# EasyEDA Pro project Ext_sensors.eprj

# Schematic Schematic1
Board Name: Board1; Create Date: 2025-08-04; Page Name: P1; Project Name: Ext_sensors; Schematic Name: Schematic1; Update Date: 2025-08-04; Company: 嘉立创EDA; Page Size: A4; Version: V1.0
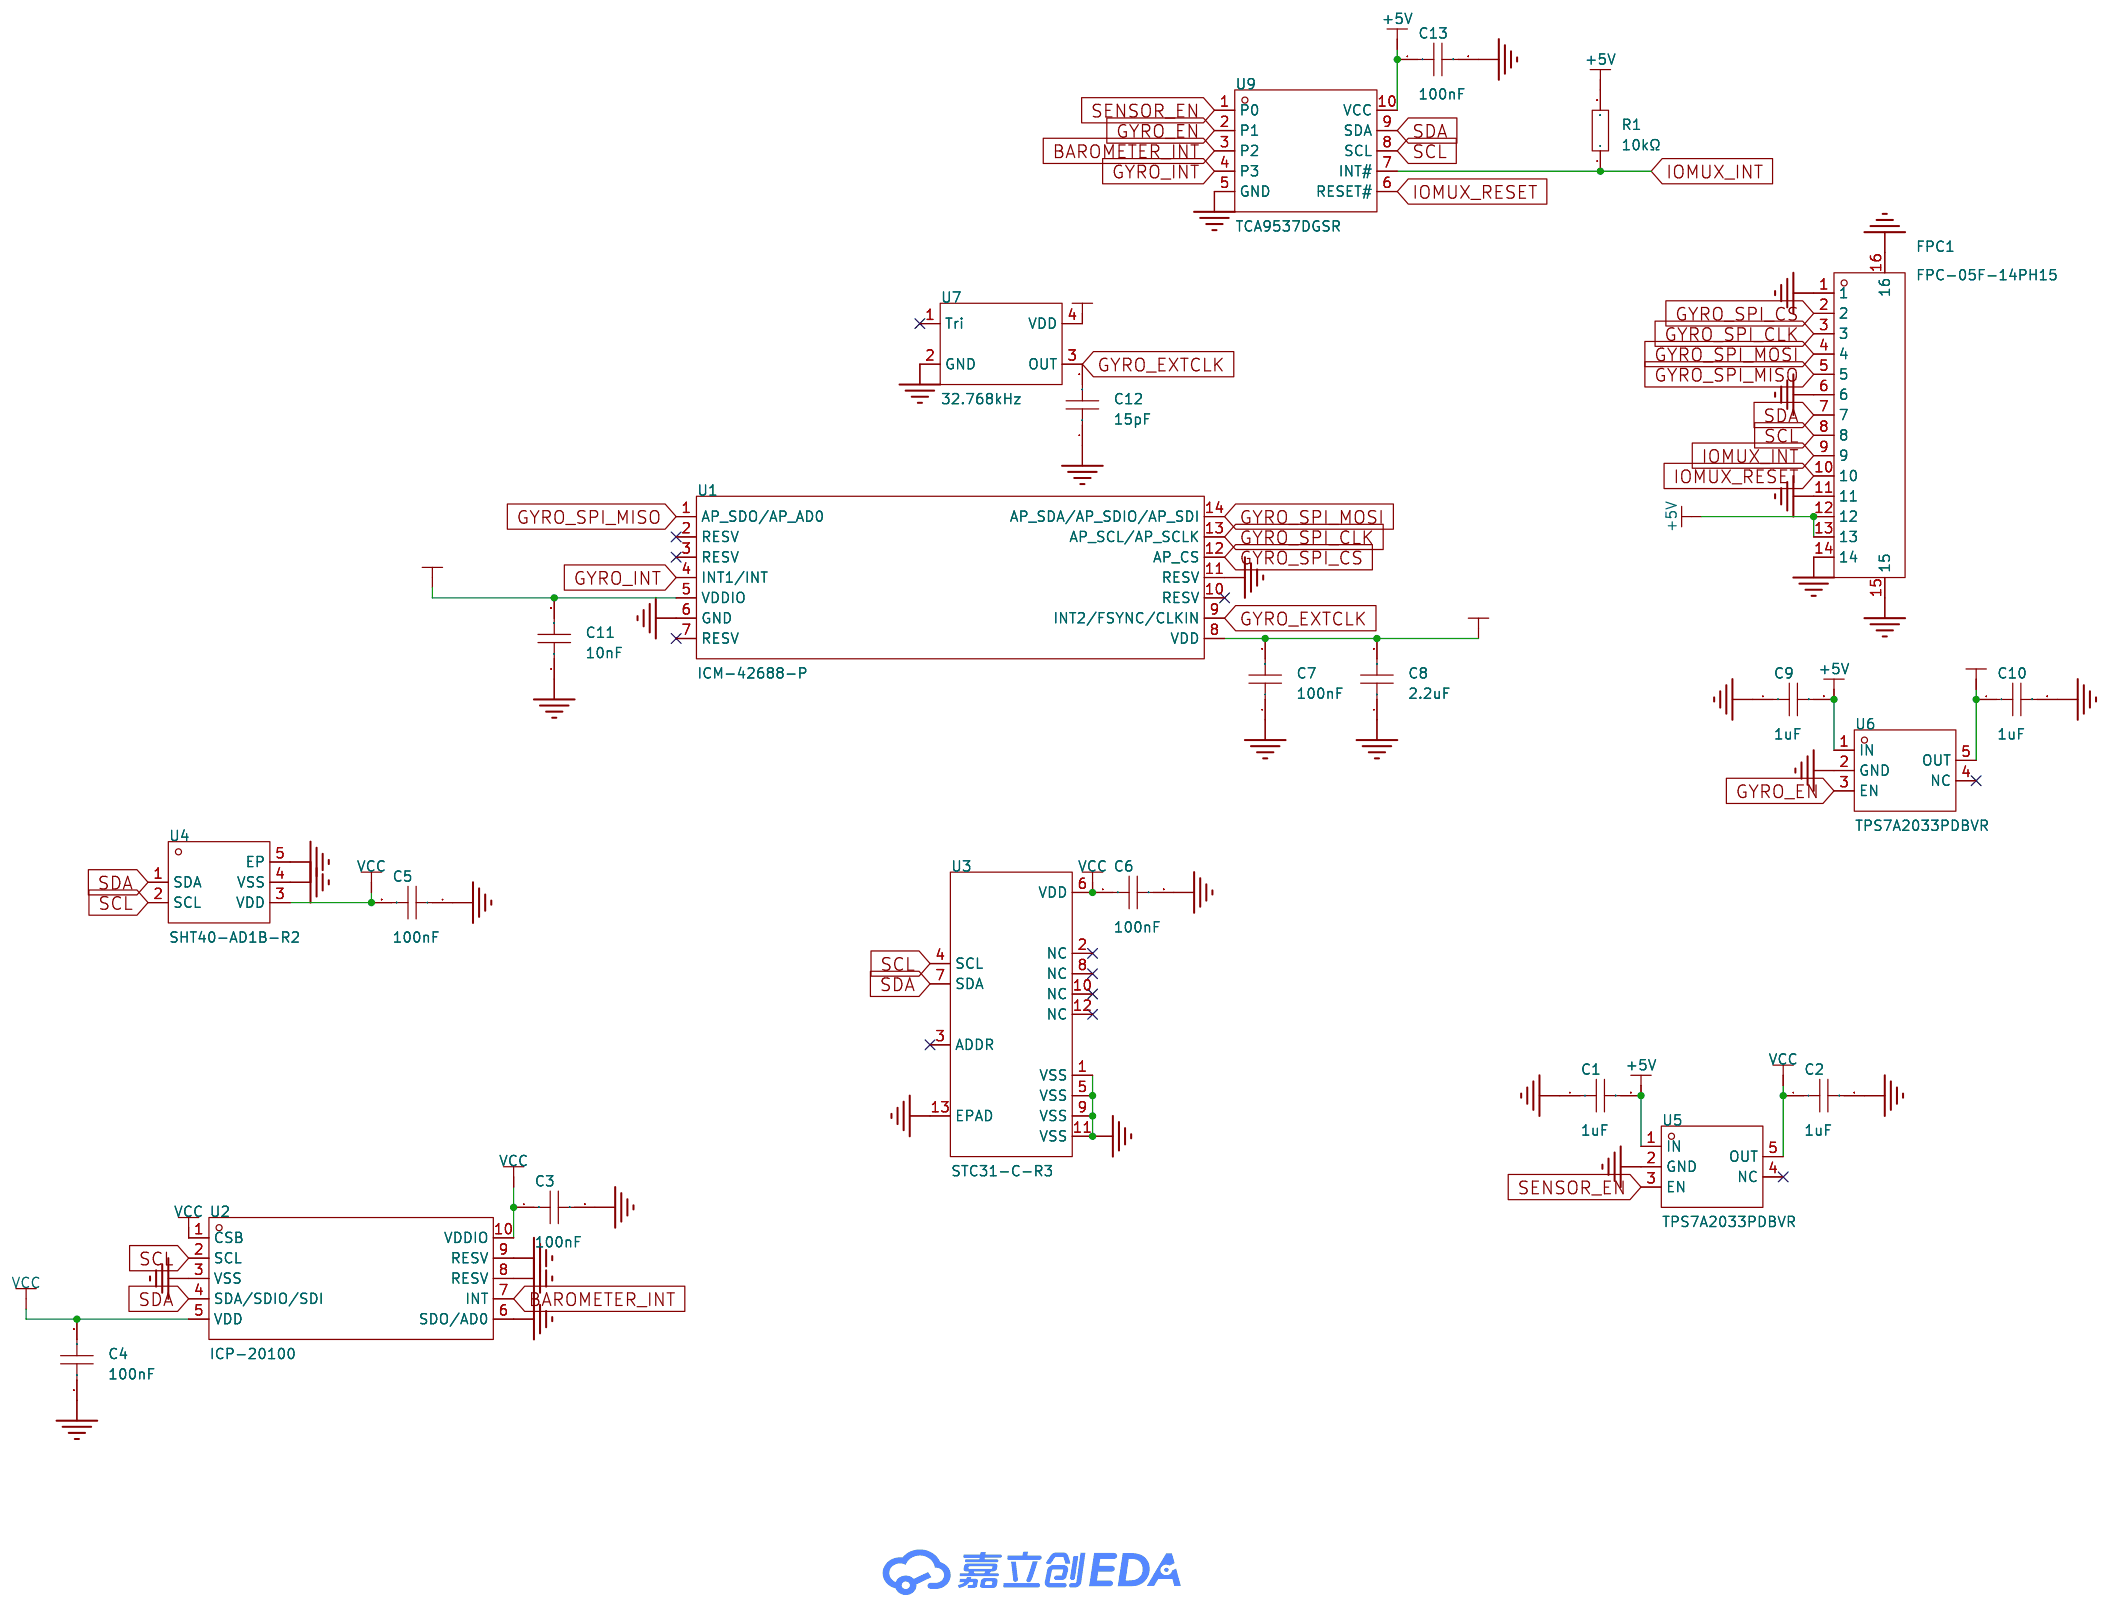
[diagram p0: schematic sheet]

## Parts
C1  1uF  [C0201]
C2  1uF  [C0201]
C3  100nF  [C01005]
C4  100nF  [C01005]
C5  100nF  [C01005]
C6  100nF  [C01005]
C7  100nF  [C01005]
C8  2.2uF  [C0201]
C9  1uF  [C0201]
C10  1uF  [C0201]
C11  10nF  [C01005]
C12  15pF  [C01005]
C13  100nF  [C01005]
FPC1  FPC-05F-14PH15  [FPC-SMD_14P-P0.50_XUNPU_FPC-05F-14PH15]
R1  10kΩ  [R0201]
U1  ICM-42688-P  [LGA-14_L3.0-W2.5-P0.50-TL]
U2  ICP-20100  [LGA-10_L2.0-W2.0-P0.50-TL_ICP-20100]
U3  STC31-C-R3  [QFN-12_L3.5-W3.0-P0.80-BL-EP]
U4  SHT40-AD1B-R2  [DFN-4_L1.5-W1.5-P0.8-TL-EP]
U5  TPS7A2033PDBVR  [SOT-23-5_L2.9-W1.6-P0.95-LS2.8-BR]
U6  TPS7A2033PDBVR  [SOT-23-5_L2.9-W1.6-P0.95-LS2.8-BR]
U7  32.768kHz  [OSC-SMD_4P-L3.2-W2.5-BL-CXC3X260000GHVRT3R]
U9  TCA9537DGSR  [VSSOP-10_L3.0-W3.0-P0.50-LS4.9-BL]

## Library data of the parts
C1 C2 C9 C10 = GRM033R61A105ME44D: LCSC Part Name: 1uF ±20% 10V; Supplier Part: C76935; Manufacturer: muRata(村田); Supplier Footprint: 0201; JLCPCB Part Class: Extended Part; Datasheet: https://atta.szlcsc.com/upload/public/pdf/source/20190904/C426118_85E81C7C1F21FC87C5FB6D536E0847B4.pdf; Supplier: LCSC; Tolerance: ±20%; Voltage Rated: 10V; Temperature Coefficient: X5R
C3-C7 C13 = GRM022R60J104KE15D: LCSC Part Name: 100nF ±10% 6.3V; Supplier Part: C161362; Manufacturer: muRata(村田); Supplier Footprint: 01005; JLCPCB Part Class: Extended Part; Datasheet: https://atta.szlcsc.com/upload/public/pdf/source/20200305/C490387_23319AE8C154DEB24C505E6C82A8106A.pdf; Supplier: LCSC; Tolerance: ±10%; Voltage Rating: 6.3V; Temperature Coefficient: X5R
C8 = GRM033R61A225ME47D: LCSC Part Name: 2.2uF ±20% 10V; Supplier Part: C319184; Manufacturer: muRata(村田); Supplier Footprint: 0201; JLCPCB Part Class: Extended Part; Datasheet: https://atta.szlcsc.com/upload/public/pdf/source/20181029/C319184_E8D08B09A5B8275146DCCD460C2C3E2F.pdf; Supplier: LCSC; Tolerance: ±20%; Voltage Rated: 10V; Temperature Coefficient: X5R
C11 = CL02A103KQ2NNXC: LCSC Part Name: 10nF ±10% 6.3V; Supplier Part: C307375; Manufacturer: SAMSUNG(三星); Supplier Footprint: 01005; JLCPCB Part Class: Extended Part; Datasheet: https://atta.szlcsc.com/upload/public/pdf/source/20160218/1457707763339.pdf; Supplier: LCSC; Tolerance: ±10%; Voltage Rating: 6.3V; Temperature Coefficient: X5R
C12 = CC0100JRNPO6BN150: LCSC Part Name: 15pF ±5% 10V; Supplier Part: C513722; Manufacturer: YAGEO(国巨); Supplier Footprint: 01005; JLCPCB Part Class: Extended Part; Datasheet: https://atta.szlcsc.com/upload/public/pdf/source/20200415/C513722_1A62C6C1B30C92176A2267B37CF1303B.pdf; Supplier: LCSC; Tolerance: ±5%; Voltage Rated: 10V; Temperature Coefficient: NP0
FPC1 = FPC-05F-14PH15: LCSC Part Name: 间距:0.5mm P数:14P 翻盖式 下接; Supplier Part: C2856818; Manufacturer: XUNPU(讯普); Supplier Footprint: SMD,P=0.5mm,卧贴; JLCPCB Part Class: 扩展库; Datasheet: https://atta.szlcsc.com/upload/public/pdf/source/20210922/C2856818_BF9A09706769A6AB1B749235C5052B10.pdf; Supplier: LCSC; Locking Feature: 翻盖式; Contact Type: 下接; Number of Contacts: 14P; Pitch: 0.5mm; Mounting Type: 卧贴; FFC, FCB Thickness: 0.3mm; Height Above Board: 1.5mm; Operating Temperature Range: -25℃~+85℃
R1 = 0201WMF1002TEE: LCSC Part Name: 10kΩ ±1% 50mW 厚膜电阻; Supplier Part: C473048; Manufacturer: UNI-ROYAL(厚声); Supplier Footprint: 0201; JLCPCB Part Class: Extended Part; Datasheet: https://atta.szlcsc.com/upload/public/pdf/source/20200306/C422600_1E6D84923E4A46A82E41ADD87F860B5C.pdf; Supplier: LCSC; Type: 厚膜电阻; Tolerance: ±1%; Power(Watts): 50mW; Overload Voltage (Max): 25V; Temperature Coefficient: ±200ppm/℃; Operating Temperature Range: -55℃~+155℃
U1 = ICM-42688-P: Supplier Part: C1850418; Manufacturer: TDK InvenSense(应美盛); Supplier Footprint: LGA-14(2.5x3); JLCPCB Part Class: 扩展库; Datasheet: https://atta.szlcsc.com/upload/public/pdf/source/20210703/CF24204867ACE5B754A2B035F23E5931.pdf; Supplier: LCSC; Sensor Type: 加速度计陀螺仪
U2 = ICP-20100: Supplier Part: C5343527; Manufacturer: TDK InvenSense(应美盛); Supplier Footprint: LGA-10L; JLCPCB Part Class: 扩展库; Datasheet: https://atta.szlcsc.com/upload/public/pdf/source/20240425/CCFF2FA4E81D8291B70FD66D3D391C92.pdf; Supplier: LCSC
U3 = STC31-C-R3: LCSC Part Name: 3.001.031; Supplier Part: C22396918; Manufacturer: Sensirion(瑞士盛思锐); Supplier Footprint: QFN-12; JLCPCB Part Class: 扩展库; Datasheet: https://atta.szlcsc.com/upload/public/pdf/source/20240619/31FA64E58453D74C28FA47B0AA865993.pdf; Supplier: LCSC
U4 = SHT40-AD1B-R2: LCSC Part Name: 3.000.465; Supplier Part: C2909890; Manufacturer: Sensirion(瑞士盛思锐); Supplier Footprint: DFN-4-EP(1.5x1.5); JLCPCB Part Class: 扩展库; Datasheet: https://atta.szlcsc.com/upload/public/pdf/source/20211021/851BA36A5CA574D725310F52CADA4510.pdf; Supplier: LCSC
U5 U6 = TPS7A2033PDBVR: LCSC Part Name: 具有高 PSRR 的 300mA、超低噪声、低 IQ、低压降 (LDO) 线性稳压器; Supplier Part: C2862740; Manufacturer: TI(德州仪器); Supplier Footprint: SOT-23-5; JLCPCB Part Class: 扩展库; Datasheet: https://www.ti.com/cn/lit/gpn/tps7a20; Supplier: LCSC; Output Type: 固定; Maximum Input Voltage: 6V; Output Voltage: 3.3V; Output Current: 300mA; Dropout Voltage: 140mV@(300mA); standby current: 15uA; Feature: 防静电保护；软启动；浪涌保护；低ESR；热保护(TSD)；欠压闭锁；过流保护(OCP)；带使能；防倒灌; Operating Temperature: -40℃~+125℃@(Tj); Output Polarity: 正极; Number of Outputs: 1
U7 = SX3M32.768KB10F20TLN: LCSC Part Name: 32.768KHz 3.3V ±20ppm 低功耗; Supplier Part: C21547575; Manufacturer: SCTF(星通时频); Supplier Footprint: SMD3225-4P; JLCPCB Part Class: 扩展库; Datasheet: https://atta.szlcsc.com/upload/public/pdf/source/20250320/8C35CF7A6F4C99F672EA1438B9D27BA5.pdf; Supplier: LCSC; Normal temperature Frequency Tolerance: ±10ppm; Output Type: CMOS; Voltage - Supply: 3.3V; Current - Supply: 7.2uA; Frequency Stability: ±20ppm; Operating Temperature: -40℃~+85℃
U9 = TCA9537DGSR: Supplier Part: C3194597; Manufacturer: TI(德州仪器); Supplier Footprint: MSOP-10; JLCPCB Part Class: 扩展库; Datasheet: https://www.ti.com/cn/lit/gpn/tca9537; Supplier: LCSC; Interface: I2C; Interrupt Output: 有中断输出; Supply Voltage: 1.65V~5.5V; Clock Frequency: 1MHz; Operating Temperature: -40℃~+125℃

## Nets
+5V: C1.2 C9.2 C13.1 FPC1.12 FPC1.13 R1.2 U5.1(IN) U6.1(IN) U9.10(VCC)
GND: C1.1 C2.2 C3.2 C4.1 C5.1 C6.2 C7.1 C8.1 C9.1 C10.2 C11.1 C12.1 C13.2 FPC1.1 FPC1.6 FPC1.11 FPC1.14 FPC1.15 FPC1.16 U1.6(GND) U1.11(RESV) U2.3(VSS) U2.6(SDO/AD0) U2.8(RESV) U2.9(RESV) U3.1(VSS) U3.5(VSS) U3.9(VSS) U3.11(VSS) U3.13(EPAD) U4.4(VSS) U4.5(EP) U5.2(GND) U6.2(GND) U7.2(GND) U9.5(GND)
VCC: C2.1 C3.1 C4.2 C5.2 C6.1 U2.1(CSB) U2.5(VDD) U2.10(VDDIO) U3.6(VDD) U4.3(VDD) U5.5(OUT)
VCC1: C7.2 C8.2 C10.1 C11.2 U1.5(VDDIO) U1.8(VDD) U6.5(OUT) U7.4(VDD)
BAROMETER_INT: U2.7(INT) U9.3(P2)
GYRO_EN: U6.3(EN) U9.2(P1)
GYRO_EXTCLK: C12.2 U1.9(INT2/FSYNC/CLKIN) U7.3(OUT)
GYRO_INT: U1.4(INT1/INT) U9.4(P3)
GYRO_SPI_CLK: FPC1.3 U1.13(AP_SCL/AP_SCLK)
GYRO_SPI_CS: FPC1.2 U1.12(AP_CS)
GYRO_SPI_MISO: FPC1.5 U1.1(AP_SDO/AP_AD0)
GYRO_SPI_MOSI: FPC1.4 U1.14(AP_SDA/AP_SDIO/AP_SDI)
IOMUX_INT: FPC1.9 R1.1 U9.7(INT#)
IOMUX_RESET: FPC1.10 U9.6(RESET#)
SCL: FPC1.8 U2.2(SCL) U3.4(SCL) U4.2(SCL) U9.8(SCL)
SDA: FPC1.7 U2.4(SDA/SDIO/SDI) U3.7(SDA) U4.1(SDA) U9.9(SDA)
SENSOR_EN: U5.3(EN) U9.1(P0)

Not connected (* = marked no-connect by the designer): U1 2(RESV)* 3(RESV)* 7(RESV)* 10(RESV)*; U3 2(NC)* 3(ADDR)* 8(NC)* 10(NC)* 12(NC)*; U5 4(NC)*; U6 4(NC)*; U7 1(Tri)*

# Board PCB1
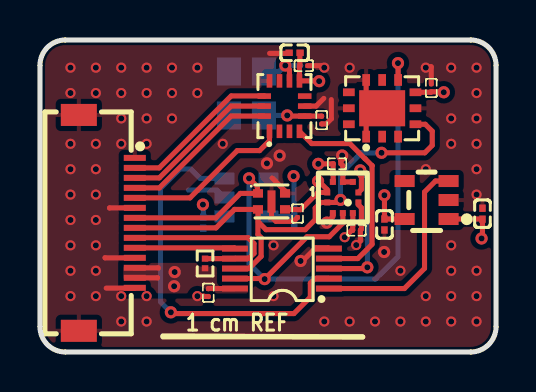
[diagram p1: board, top side]
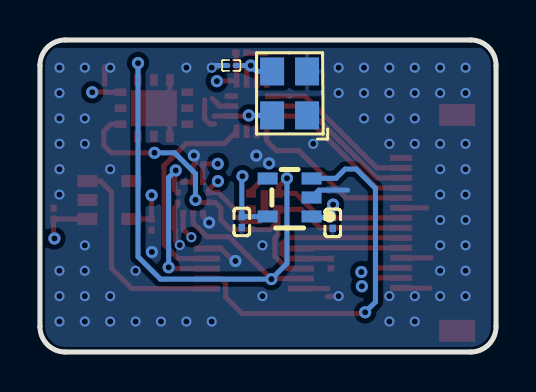
[diagram p2: board, bottom side, seen from below]

Outline 22.82 x 15.61 mm; copper layers: Top Layer, Inner1, Inner2, Bottom Layer. Coordinates in mm from the lower left corner of the outline.
Outline path: 0,14.34 0,1.27 arc(0.37,0.37) 1.27,0 21.55,0 arc(22.45,0.37) 22.82,1.27 22.82,14.34 arc(22.45,15.24) 21.55,15.61 1.27,15.61 arc(0.37,15.24) 0,14.34
Stack: Top Layer 0.035mm 外层铜厚1oz / Dielectric1 0.2104mm 7628 RC49% 8.6mil / Inner1 0.0152mm 内层铜厚 / Dielectric2 1.065mm 1.1mm H/HOZ Copper / Inner2 0.0152mm 内层铜厚 / Dielectric3 0.2104mm 7628 RC49% 8.6mil / Bottom Layer 0.035mm 外层铜厚1oz

## Design rules (mm)
template: 自定义配置
spacing copperThickness1oz (default): track to track 0.102, other pairs 0.152 to 0.3
spacing copperThickness2oz: track to track 0.203, other pairs 0.152 to 0.3
track width copperThickness1oz (default): min 0.127, default 0.254, max 2.54
track width copperThickness2oz: min 0.203, default 0.254, max 2.54
differential pair differentialPair (default): width min 0.127, default 0.254, max 2.54; gap min 0.152, default 0.152
via viaSize (default): diameter min 0.5, default 0.61, max 10; hole min 0.3, default 0.305, max 6.3
net +5V uses copperRegion1

## Placement (name value [footprint] x y rotation side)
C1  1uF  [C0201]  22.14 6.92 270 top
C2  1uF  [C0201]  17.24 6.38 270 top
C3  100nF  [C01005]  14.87 9.42 0 top
C4  100nF  [C01005]  15.84 6.09 180 top
C5  100nF  [C01005]  12.89 6.93 90 top
C6  100nF  [C01005]  19.58 13.21 90 top
C7  100nF  [C01005]  13.2 14.32 180 top
C8  2.2uF  [C0201]  12.74 14.97 0 top
C9  1uF  [C0201]  8.17 6.46 90 bottom
C10  1uF  [C0201]  12.72 6.51 270 bottom
C11  10nF  [C01005]  14.1 11.6 90 top
C12  15pF  [C01005]  13.25 14.34 180 bottom
C13  100nF  [C01005]  8.42 2.97 270 top
FPC1  FPC-05F-14PH15  [FPC-SMD_14P-P0.50_XUNPU_FPC-05F-14PH15]  3.34 6.46 270 top
R1  10kΩ  [R0201]  8.26 4.43 270 top
U1  ICM-42688-P  [LGA-14_L3.0-W2.5-P0.50-TL]  12.23 12.3 90 top
U2  ICP-20100  [LGA-10_L2.0-W2.0-P0.50-TL_ICP-20100]  15.16 7.73 0 top
U3  STC31-C-R3  [QFN-12_L3.5-W3.0-P0.80-BL-EP]  17.12 12.19 0 top
U4  SHT40-AD1B-R2  [DFN-4_L1.5-W1.5-P0.8-TL-EP]  11.59 7.53 0 top
U5  TPS7A2033PDBVR  [SOT-23-5_L2.9-W1.6-P0.95-LS2.8-BR]  19.35 7.6 0 top
U6  TPS7A2033PDBVR  [SOT-23-5_L2.9-W1.6-P0.95-LS2.8-BR]  10.33 7.73 180 bottom
U7  32.768kHz  [OSC-SMD_4P-L3.2-W2.5-BL-CXC3X260000GHVRT3R]  10.33 12.94 90 bottom
U9  TCA9537DGSR  [VSSOP-10_L3.0-W3.0-P0.50-LS4.9-BL]  12.11 4.18 90 top

## Footprints (pads in the part's own frame, mm; a bottom-side part is the same pattern mirrored in y, then rotated)
C0201
  rect 0.368x0.324 smd: 1(-0.275,0) 2(0.275,0)
C01005
  rect 0.21x0.22 smd: 1(-0.195,0) 2(0.195,0)
DFN-4_L1.5-W1.5-P0.8-TL-EP
  rect 0.505x0.42 smd: 1(-0.677,0.4) 2(-0.677,-0.4) 3(0.677,-0.4) 4(0.677,0.4)
  rect 0.4x1.1 smd: 5(0,0)
FPC-SMD_14P-P0.50_XUNPU_FPC-05F-14PH15
  rect 0.3x1.1 smd: 1(-3.25,1.4) 2(-2.75,1.4) 3(-2.25,1.4) 4(-1.75,1.4) 5(-1.25,1.4) 6(-0.75,1.4) 7(-0.25,1.4) 8(0.25,1.4) 9(0.75,1.4) 10(1.25,1.4) 11(1.75,1.4) 12(2.25,1.4) 13(2.75,1.4) 14(3.25,1.4)
  rect 1.1x1.8 smd: 15(5.4,-1.4) 16(-5.4,-1.4)
LGA-10_L2.0-W2.0-P0.50-TL_ICP-20100
  rect 0.3x0.3 smd: 1(-0.78,0.25) 2(-0.78,-0.25) 3(-0.5,-0.78) 4(0,-0.78) 5(0.5,-0.78) 6(0.78,-0.25) 7(0.78,0.25) 8(0.5,0.78) 9(0,0.78) 10(-0.5,0.78)
LGA-14_L3.0-W2.5-P0.50-TL
  rect 0.675x0.28 smd: 1(-1.262,0.75) 2(-1.262,0.25) 3(-1.262,-0.25) 4(-1.262,-0.75) 8(1.262,-0.75) 9(1.262,-0.25) 10(1.262,0.25) 11(1.262,0.75)
  rect 0.28x0.675 smd: 5(-0.5,-1.012) 6(0,-1.012) 7(0.5,-1.012) 12(0.5,1.012) 13(0,1.012) 14(-0.5,1.012)
OSC-SMD_4P-L3.2-W2.5-BL-CXC3X260000GHVRT3R
  rect 1.4x1.2 smd: 1(-1.1,-0.875) 2(1.1,-0.875) 3(1.1,0.875) 4(-1.1,0.875)
QFN-12_L3.5-W3.0-P0.80-BL-EP
  rect 0.386x0.585 smd: 1(-0.8,-1.417) 2(0,-1.417) 3(0.8,-1.417) 7(0.8,1.417) 8(0,1.417) 9(-0.8,1.417)
  rect 0.585x0.386 smd: 4(1.667,-0.8) 5(1.667,0) 6(1.667,0.8) 10(-1.667,0.8) 11(-1.667,0) 12(-1.667,-0.8)
  rect 2.3x1.8 smd: 13(0,0)
R0201
  rect 0.303x0.324 smd: 1(-0.241,0) 2(0.241,0)
SOT-23-5_L2.9-W1.6-P0.95-LS2.8-BR
  rect 1x0.6 smd: 1(1.1,-0.95) 2(1.1,0) 3(1.1,0.95) 4(-1.1,0.95) 5(-1.1,-0.95)
VSSOP-10_L3.0-W3.0-P0.50-LS4.9-BL
  rect 0.3x1.3 smd: 1(-1,-2.35) 2(-0.5,-2.35) 3(0,-2.35) 4(0.5,-2.35) 5(1,-2.35) 6(1,2.35) 7(0.5,2.35) 8(0,2.35) 9(-0.5,2.35) 10(-1,2.35)

## Nets
As in the schematic.

Pads without a net: U1 2 3 7 10; U3 2 3 8 10 12; U5 4; U6 4; U7 1

## Via types
v1: diameter 0.61, hole 0.305, Top Layer to Bottom Layer, 26 vias
v2: diameter 0.508, hole 0.305, Top Layer to Bottom Layer, 68 vias

## Routing (per net, layer and track width the routed paths; a pad name or vN(x,y) marks a point on that pad's centre or on a via; arc(x,y) is an arc through that point)
+5V: length 8
  Top Layer w0.254: U5.1 22.14,6.65 C1.2 22.14,5.73 22.13,5.72 ; FPC1.12 5.91,4.21 5.92,4.2 ; U9.10 8.44,3.18 C13.1 ; FPC1.13 5.88,3.71 5.88,3.71
  Bottom Layer w0.254: U6.1 9.18,6.74 C9.2 8.17,7.36 v1(8.15,7.38)
  vias: v1(6.74,4) v1(6.71,3.29) v1(22.1,5.68)
GND: length 26.2
  Top Layer w0.254: U1.6 13.82,12.3 14.2,12.69 ; U2.3 14.66,6.77 v1(14.36,6.47) ; v2(7.88,2.8) 8.18,2.8 8.2,2.78 8.42,2.78 C13.2 ; v1(13.04,4.56) 13.14,4.56 13.79,5.21 14.43,5.21 U9.5 ; C6.2 19.58,14.27 19.57,14.28 ; v1(15.12,9.83) 15.12,9.71 15.06,9.64 15.06,9.57 15.06,9.56 C3.2 15.16,9.32 U2.9 U2.8 ; U4.4 12.26,8.06 11.62,8.7 ; v2(14.23,14.23) 14.13,14.32 C7.1 ; C5.1 12.7,6.54 11.81,6.54 11.59,6.76 U4.5 ; 3.48,7.2 3.49,7.21 FPC1.6 ; 3.31,3.2 4.73,3.2 FPC1.14 ; C8.1 12.44,14.94 11.49,14.94 ; C11.1 14.1,11.41 14.32,11.41 14.58,11.67 14.58,12.63 ; 3.25,4.72 3.26,4.71 FPC1.11 ; U2.6 15.94,7.37 16.08,7.22 16.08,6.14 C4.1 16.03,5.56 v2(15.83,5.35) ; U3.9 16.32,12.99 U3.13 16.32,11.39 U3.1
  Bottom Layer w0.254: U6.2 8.86,8.1 7.43,8.1 ; v2(14.23,14.23) 14.12,14.34 C12.1
  vias: v1(11.36,9.44) v1(11.99,9.83) v1(17.22,5) v2(1.53,14.23) v2(1.53,12.96) v2(1.53,10.42) v2(1.53,9.15) v2(1.53,7.88) v2(1.53,6.61) v2(1.53,5.34) v2(1.53,4.07) v2(1.53,2.8) v2(2.8,14.23) v2(2.8,12.96) v2(2.8,10.42) v2(2.8,9.15) v2(2.8,7.88) v2(2.8,6.61) v2(2.8,5.34) v2(2.8,4.07) v2(2.8,2.8) v2(4.07,14.23) v2(4.07,12.96) v2(4.07,11.69) v2(4.07,10.42) v2(4.07,2.8) v2(4.07,1.53) v2(5.34,14.23) v2(5.34,12.96) v2(5.34,11.69) v2(5.34,10.42) v2(5.34,2.8) v2(5.34,1.53) v2(6.61,14.23) v2(6.61,12.96) v2(6.61,11.69) v2(7.88,14.23) v2(7.88,12.96) v2(9.15,10.42) v2(11.69,5.34) v2(11.69,2.8) v2(14.23,1.53) v2(15.5,14.23) v2(15.5,1.53) v2(16.77,1.53) v2(18.04,4.07) v2(18.04,1.53) v2(19.31,14.23) v2(19.31,9.15) v2(19.31,2.8) v2(19.31,1.53) v2(20.58,14.23) v2(20.58,11.69) v2(20.58,10.42) v2(20.58,5.34) v2(20.58,4.07) v2(20.58,2.8) v2(20.58,1.53) v2(21.85,14.23) v2(21.85,12.96) v2(21.85,11.69) v2(21.85,10.42) v2(21.85,9.15) v2(21.85,7.88) v2(21.85,4.07) v2(21.85,2.8) v2(21.85,1.53)
VCC: length 9.8
  Top Layer w0.254: v1(13.93,9.41) 14.67,9.41 C3.1 14.67,8.53 U2.10 ; v2(15.25,5.74) 15.6,6.09 C4.2 15.65,6.1 15.65,6.32 15.66,6.32 U2.5 ; 14,8.5 14.38,8.12 U2.1 13.91,7.98 13.05,7.12 C5.2 12.88,7.13 U4.3 ; v1(17.24,7.84) 17.24,7.84 C2.1 U5.5 ; U3.6 19.56,12.99 C6.1 20.18,13.02 v1(20.21,13)
  vias: v1(13.92,8.55)
VCC1: length 8.6
  Top Layer w0.254: v1(12.37,11.84) 12.41,11.8 U1.5 14.09,11.8 C11.2 ; C8.2 13,14.96 C7.2 12.98,14.3 U1.8 13.96,13.57 v1(13.97,13.55)
  Bottom Layer w0.254: v1(12.37,11.84) 12.37,11.84 U7.4 ; v1(12.69,8.8) 12.72,8.77 C10.1 U6.5
BAROMETER_INT: length 8.1
  Top Layer w0.254: v1(16.03,9.09) 16.03,8.83 16.08,8.78 16.08,8.13 U2.7 ; v1(16.38,4.24) 16.32,4.18 U9.3
  Bottom Layer w0.254: v1(16.03,9.09) 16.38,8.73 v1(16.38,4.24)
GYRO_EN: length 19.2
  Top Layer w0.254: 6.65,1.92 12.71,1.92 13.53,2.75 13.53,3.44 13.77,3.68 14.45,3.68 U9.2
  Bottom Layer w0.254: U6.3 9.22,8.69 8.01,8.69 7.55,9.15 7,9.15 6.03,8.19 6.03,2.51 v1(6.55,1.99)
GYRO_EXTCLK: length 2.8
  Top Layer w0.254: v1(12.28,14.33) 12.48,14.13 U1.9
  Bottom Layer w0.254: U7.3 11.98,14.04 v1(12.28,14.33) 13.05,14.33
GYRO_INT: length 10.7
  Top Layer w0.254: U1.4 13.6,10.43 15.5,10.43 16.26,9.67 16.27,9.67 16.61,9.33 16.61,9.32 16.62,9.32 16.62,5.39 15.9,4.68 U9.4
GYRO_SPI_CLK: length 8
  Top Layer w0.254: FPC1.3 5.97,8.71 9.56,12.3 U1.13
GYRO_SPI_CS: length 8
  Top Layer w0.254: FPC1.2 5.97,9.21 9.57,12.81 11.21,12.81 U1.12
GYRO_SPI_MISO: length 8.4
  Top Layer w0.254: FPC1.5 7.51,7.71 9.87,10.08 10.99,10.08 11.48,10.57 U1.1
GYRO_SPI_MOSI: length 8
  Top Layer w0.254: FPC1.4 5.97,8.21 9.57,11.8 U1.14
IOMUX_INT: length 9.1
  Top Layer w0.254: FPC1.9 4.75,5.72 10.42,5.72 10.71,5.42 10.71,4.93 10.46,4.68 9.77,4.68 U9.7 9.75,4.67 R1.1
IOMUX_RESET: length 5
  Top Layer w0.254: FPC1.10 9.72,5.21 U9.6
SCL: length 24.1
  Top Layer w0.254: v1(17.09,9.97) 19.26,9.97 19.63,10.34 19.63,11.05 19.28,11.39 U3.4 ; 9.76,4.17 10.46,4.17 11.07,4.79 11.07,5.72 10.91,5.88 U4.2 9.73,7.13 8.81,6.21 FPC1.8 ; v1(15.04,7.61) 14.91,7.48 U2.2 14.05,7.48 13.77,7.2 13.77,6.62 13.27,6.12 11.31,6.12 10.92,6.51
  Bottom Layer w0.254: v1(15.04,7.61) 15.04,8.92 16.08,9.97 17.22,9.97
SDA: length 37.7
  Top Layer w0.254: U2.4 15.16,6.45 14.47,5.77 13.36,5.77 v1(11.24,3.65) 11.22,3.68 U9.9 ; 10.88,7.93 10.88,8.27 v1(10.46,8.69) ; 10.88,7.93 10.88,7.91 ; 10.88,7.93 10.03,7.93 8.8,6.71 FPC1.7 ; U3.7 17.92,14.45 v1(17.91,14.45)
  Bottom Layer w0.254: v1(17.91,14.45) 17.91,4.77 16.79,3.65 v1(11.24,3.65) 10.46,4.43 v1(10.46,8.69)
SENSOR_EN: length 10.5
  Top Layer w0.254: U9.1 18.23,3.18 19.24,4.18 19.24,8 19.79,8.55 U5.3

## Copper pours and planes (outline as drawn; the poured copper is in the pictures)
+5V on Top Layer: 4.17,4.46 10.41,4.46 10.41,2.93 4.17,2.93
+5V on Inner1: 0.46,15.23 22.84,15.23 22.84,0.08 0.46,0.08
GND on Top Layer: 0.06,15.64 22.87,15.64 22.87,0.11 0.06,0.11
GND on Bottom Layer: 0.24,15.22 22.84,15.22 22.84,0.07 0.24,0.07
GND on Inner2: 0.26,15.35 22.57,15.35 22.57,0.26 0.26,0.26
VCC on Inner1: 19.01,5.01 18.91,4.91 13.67,4.91 13.61,4.85 13.61,10.87 13.65,10.91 16.1,13.36 16.1,14.85 20.49,14.85 20.51,14.84 20.51,11.93 20.56,11.87 19.04,11.87 19.01,11.84
VCC1 on Inner1: 14.66,14.2 15.63,13.28 15.58,13.26 15.55,10.65 13.13,10.66 13.13,6.39 10.3,6.39 10.3,13.13 13.13,13.13 13.13,13.06 13.49,13.06 13.49,14.2

## Text on the board
Top Silkscreen Layer: 1 cm REF
